# EAGLE design lidar_made_by_apple (EAGLE 9.6.2)
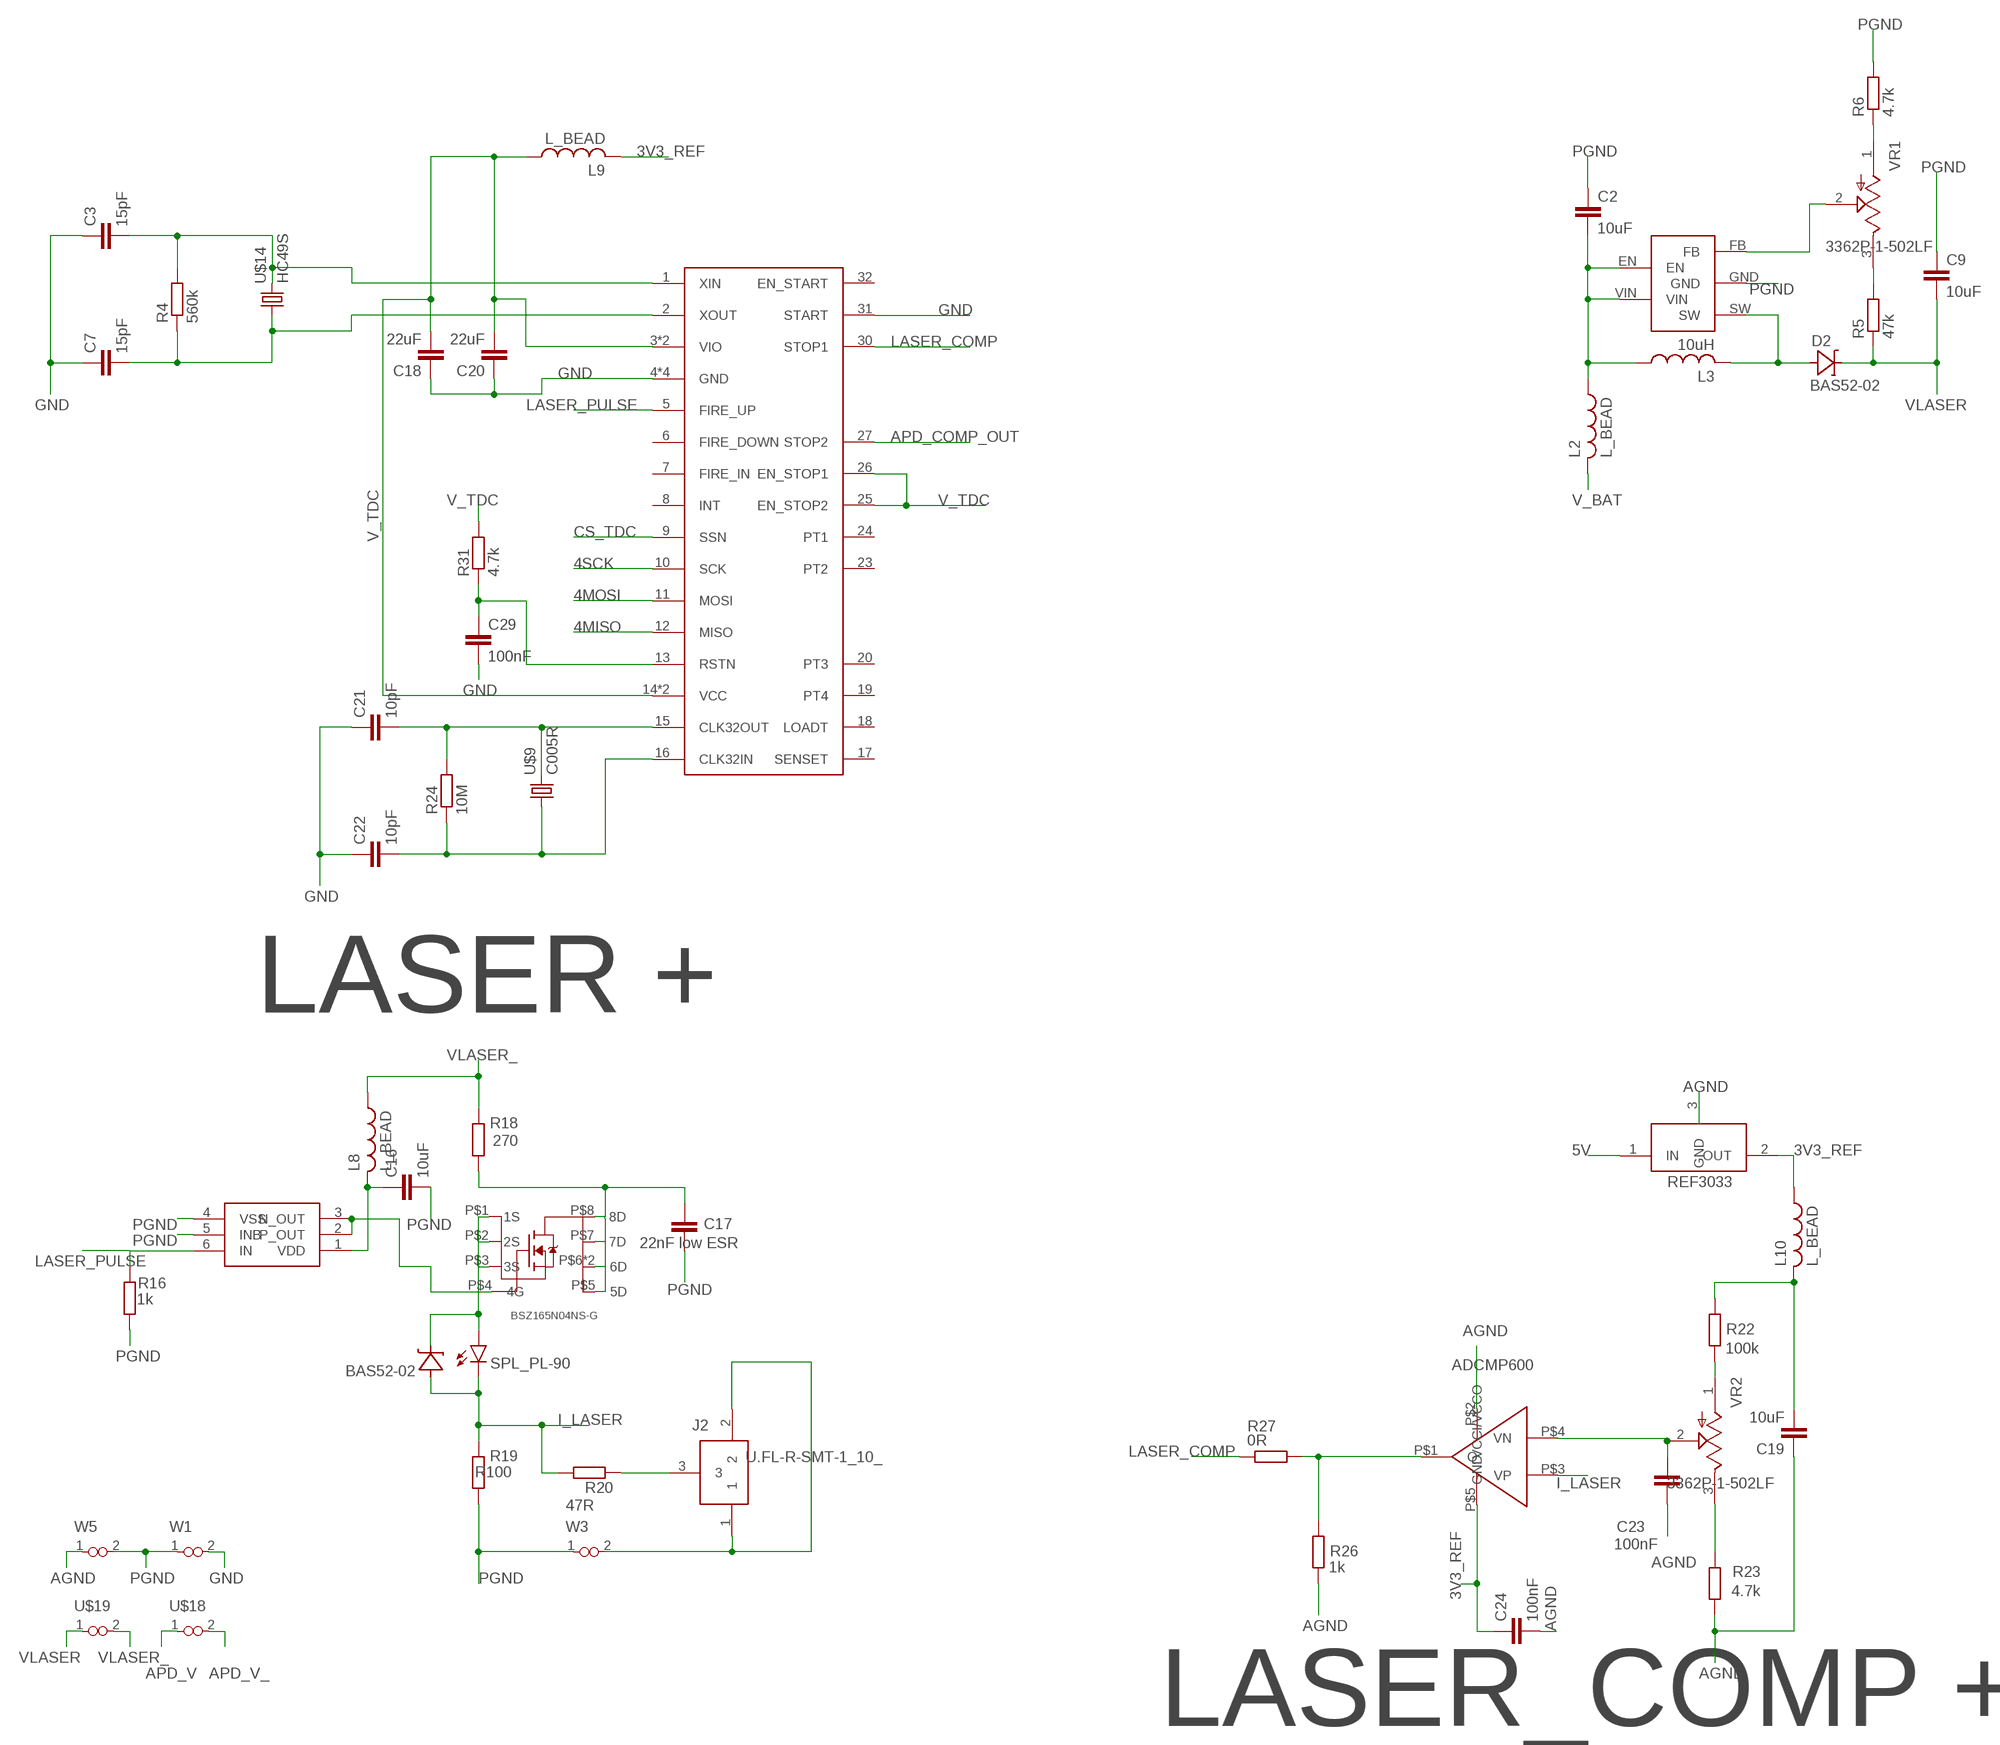
[diagram p0: schematic, sheet 1, part 1 of 2]
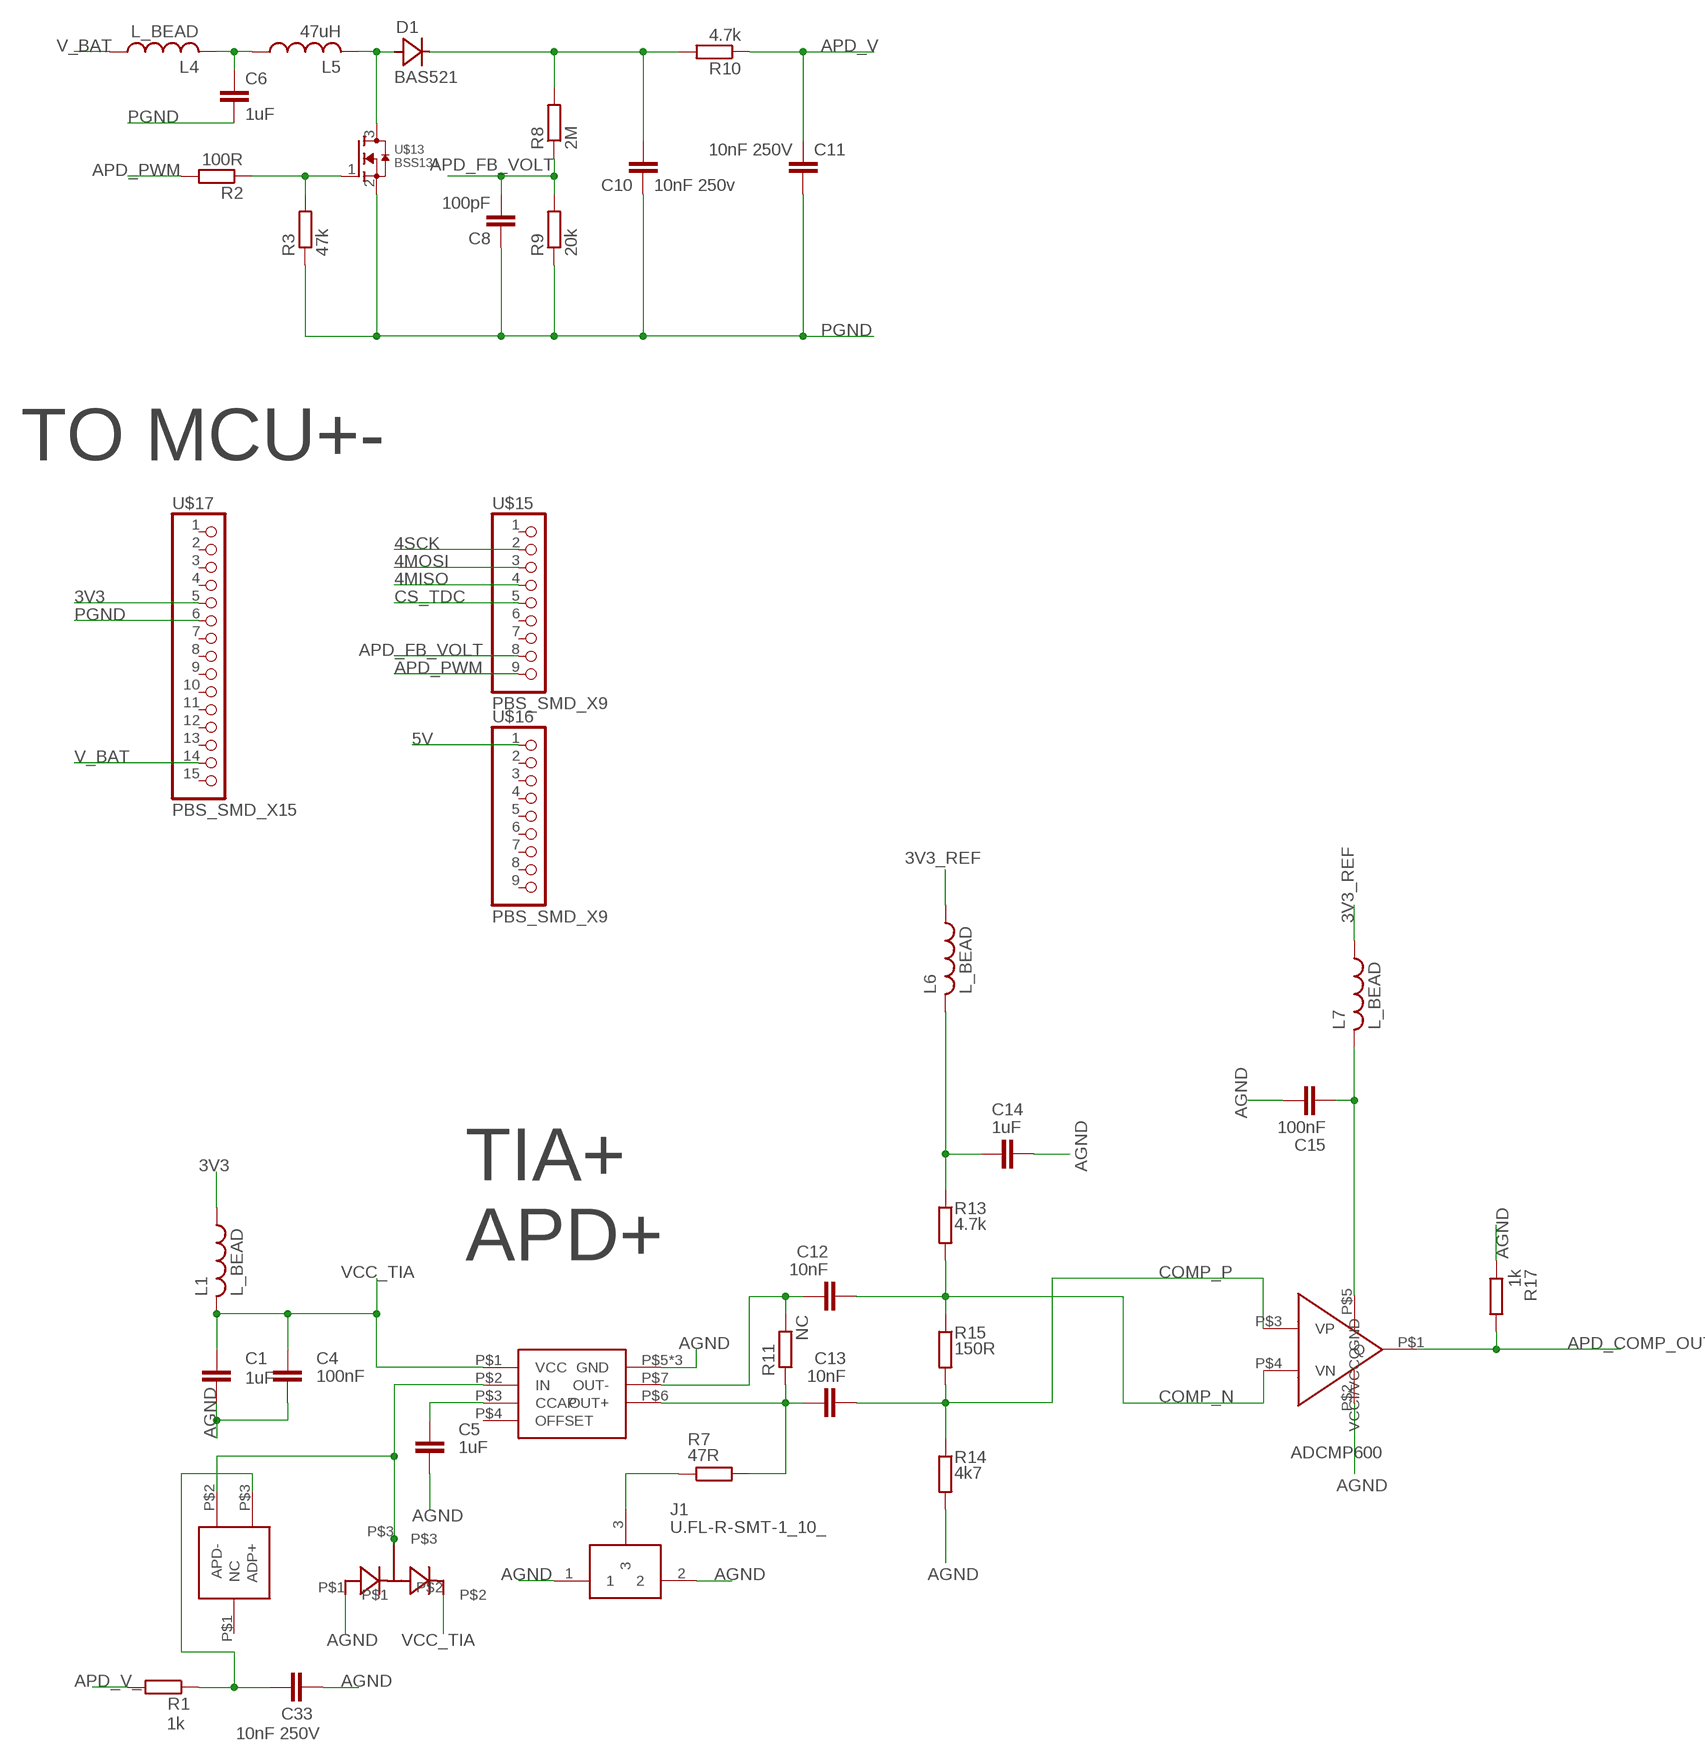
[diagram p1: schematic, sheet 1, part 2 of 2]

## Parts
C1  1uF  C-EUC0603  [C0603]
C2  10uF  C-EUC1206  [C1206]
C3  15pF  C-EUC0603  [C0603]
C4  100nF  C-EUC0603  [C0603]
C5  1uF  C-EUC0603  [C0603]
C6  1uF  C-EUC0603  [C0603]
C7  15pF  C-EUC0603  [C0603]
C8  100pF  C-EUC0603  [C0603]
C9  10uF  C-EUC1206  [C1206]
C10  10nF 250v  C-EUC0805  [C0805]
C11  10nF 250V  C-EUC0805  [C0805]
C12  10nF  C-EUC0603  [C0603]
C13  10nF  C-EUC0603  [C0603]
C14  1uF  C-EUC0603  [C0603]
C15  100nF  C-EUC0603  [C0603]
C16  10uF  C-EUC1206  [C1206]
C17  22nF low ESR  C-EUC0603  [C0603]
C18  22uF  C-EUC1206  [C1206]
C19  10uF  C-EUC1206  [C1206]
C20  22uF  C-EUC1206  [C1206]
C21  10pF  C-EUC0603  [C0603]
C22  10pF  C-EUC0603  [C0603]
C23  100nF  C-EUC0603  [C0603]
C24  100nF  C-EUC0603  [C0603]
C29  100nF  C-EUC0603  [C0603]
C33  10nF 250V  C-EUC0805  [C0805]
D1  BAS521  [SOD523]
D2  BAS52-02  [SOD523]
D6  BAV99  [BAV99]
J1  U.FL-R-SMT-1_10_  [U.FL-R-SMT-1(10)]
J2  U.FL-R-SMT-1_10_  [U.FL-R-SMT-1(10)]
L1  L_BEAD  [L_BEAD]
L2  L_BEAD  [L_BEAD]
L3  10uH  L_15MKH  [L_12X12]
L4  L_BEAD  [L_BEAD]
L5  47uH  CM322522-470KL  [1210]
L6  L_BEAD  [L_BEAD]
L7  L_BEAD  [L_BEAD]
L8  L_BEAD  [L_BEAD]
L9  L_BEAD  [L_BEAD]
L10  L_BEAD  [L_BEAD]
R1  1k  R-EU_R0603  [R0603]
R2  100R  R-EU_R0603  [R0603]
R3  47k  R-EU_R0603  [R0603]
R4  560k  R-EU_R0603  [R0603]
R5  47k  R-EU_R0603  [R0603]
R6  4.7k  R-EU_R0603  [R0603]
R7  47R  R-EU_R0603  [R0603]
R8  2M  R-EU_R0603  [R0603]
R9  20k  R-EU_R0603  [R0603]
R10  4.7k  R-EU_R0603  [R0603]
R11  NC  R-EU_R0603  [R0603]
R13  4.7k  R-EU_R0603  [R0603]
R14  4k7  R-EU_R0603  [R0603]
R15  150R  R-EU_R0603  [R0603]
R16  1k  R-EU_R0603  [R0603]
R17  1k  R-EU_R0603  [R0603]
R18  270  R-EU_R0603  [R0603]
R19  R100  R-EU_R2512  [R2512]
R20  47R  R-EU_R0603  [R0603]
R22  100k  R-EU_R0603  [R0603]
R23  4.7k  R-EU_R0603  [R0603]
R24  10M  R-EU_R0603  [R0603]
R26  1k  R-EU_R0603  [R0603]
R27  0R  R-EU_R0603  [R0603]
R31  4.7k  R-EU_R0603  [R0603]
REF3033  REF3033  [SOT23-3]
U$2  BSZ165N04NS-G  [BSZ165N04NS-G]
U$3  BAS52-02  [SOD523]
U$4  ADCMP600  [ADCMP600]
U$5  MAX40658-8-TDFN-3X3MM  [MAX40658-8-TDFN-3X3MM]
U$6  SPL_PL-90  [SPL_PL-90]
U$7  MTAPD-07-013  [MAPD-07-013]
U$8  ADCMP600  [ADCMP600]
U$9  C005R  [C005R]
U$10  TDC-GP21  [TDC-GP21]
U$11  MIC2288  [MIC2288]
U$12  LM5114  [SOT23-6]
U$13  BSS131  [SOT23-3]
U$14  HC49S  [HC49S]
U$15  PBS_SMD_X9  [PBS_SMD_X9]
U$16  PBS_SMD_X9  [PBS_SMD_X9]
U$17  PBS_SMD_X15  [PBD_SMD_X15]
U$18  VIAS-CONNECT  [VIAS-CONNECT]
U$19  VIAS-CONNECT  [VIAS-CONNECT]
VR1  3362P-1-502LF  [TRIM_3362P-1-502LF]
VR2  3362P-1-502LF  [TRIM_3362P-1-502LF]
W1  VIAS-CONNECT  [VIAS-CONNECT]
W3  VIAS-CONNECT  [VIAS-CONNECT]
W5  VIAS-CONNECT  [VIAS-CONNECT]

## Nets
3V3: L1.1 U$17.5
3V3_REF: C24.1 L6.1 L7.1 L9.2 L10.1 REF3033.2(OUT) U$4.P$5(VCCI/VCCO)
4MISO: U$10.12(MISO) U$15.4
4MOSI: U$10.11(MOSI) U$15.3
4SCK: U$10.10(SCK) U$15.2
5V: REF3033.1(IN) U$16.1
AGND: C1.2 C4.2 C5.2 C14.1 C15.1 C19.1 C23.2 C24.2 C33.2 D6.P$1 J1.1 J1.2 R14.2 R17.1 R23.1 R26.1 REF3033.3(GND) U$4.P$2(GND) U$5.P$5(GND) U$5.P$8(GND) U$5.P$9(GND) U$8.P$2(GND) W5.1
APD_COMP_OUT: R17.2 U$8.P$1(Q) U$10.27(STOP2)
APD_FB_VOLT: C8.2 R8.1 R9.2 U$15.8
APD_PWM: R2.2 U$15.9
APD_V: C11.2 R10.1 U$18.1
APD_V_: R1.2 U$18.2
COMP_N: C12.2 R13.2 R15.1 U$8.P$4(VN)
COMP_P: C13.2 R14.1 R15.2 U$8.P$3(VP)
CS_TDC: U$10.9(SSN) U$15.5
GND: C3.1 C7.1 C18.1 C20.1 C21.1 C22.1 C29.2 U$10.4(GND) U$10.21(GND) U$10.28(GND) U$10.31(START) U$10.P$1(GND) W1.2
I_LASER: R19.2 R20.2 U$3.P$2(A) U$4.P$3(VP) U$6.P$2(C)
LASER_COMP: R27.1 U$10.30(STOP1)
LASER_PULSE: R16.2 U$10.5(FIRE_UP) U$12.6(IN)
N$1: U$2.P$4(4G) U$12.2(P_OUT) U$12.3(N_OUT)
N$2: C16.1 L8.2 U$12.1(VDD)
N$3: C17.2 R18.1 U$2.P$5(5D) U$2.P$6(6D) U$2.P$7(7D) U$2.P$8(8D) U$2.P$9(6D)
N$4: U$2.P$1(1S) U$2.P$2(2S) U$2.P$3(3S) U$3.P$1(C) U$6.P$1(A)
N$5: C23.1 U$4.P$4(VN) VR2.2(WIPER)
N$6: C19.2 L10.2 R22.2
N$8: D6.P$3 U$5.P$2(IN) U$7.P$2(APD-)
N$9: C5.1 U$5.P$3(CCAP)
N$10: C12.1 R11.2 U$5.P$7(OUT-)
N$11: C13.1 R7.2 R11.1 U$5.P$6(OUT+)
N$12: J1.3 R7.1
N$13: C33.1 R1.1 U$7.P$3(ADP+)
N$14: C14.2 L6.2 R13.1
N$15: C15.2 L7.2 U$8.P$5(VCCI/VCCO)
N$16: J2.3 R20.1
N$17: R26.2 R27.2 U$4.P$1(Q)
N$18: J2.1 J2.2 W3.2
N$19: C7.2 R4.1 U$10.2(XOUT) U$14.P$1
N$20: C29.1 R31.1 U$10.13(RSTN)
N$21: C2.2 L2.1 L3.P$1 U$11.EN U$11.VIN
N$22: C21.2 R24.2 U$9.P$2 U$10.15(CLK32OUT)
N$23: C3.2 R4.2 U$10.1(XIN) U$14.P$2
N$25: C22.2 R24.1 U$9.P$1 U$10.16(CLK32IN)
N$26: D2.P$2(A) L3.P$2 U$11.SW
N$27: U$11.FB VR1.2(WIPER)
N$29: R2.1 R3.2 U$13.1(G)
N$31: D1.P$2 L5.2 U$13.3(D)
N$32: C10.2 D1.P$1 R8.2 R10.2
N$33: R6.1 VR1.1(CCW)
N$35: R5.2 VR1.3(CW)
N$36: C6.1 L4.2 L5.1
N$37: R22.1 VR2.1(CCW)
N$38: R23.2 VR2.3(CW)
PGND: C2.1 C6.2 C8.1 C9.1 C10.1 C11.1 C16.2 C17.1 R3.1 R6.2 R9.1 R16.1 R19.1 U$11.GND U$12.4(VSS) U$12.5(INB) U$13.2(S) U$17.6 W1.1 W3.1 W5.2
V_BAT: L2.2 L4.1 U$17.14
V_TDC: C18.2 C20.2 L9.1 R31.2 U$10.3(VIO) U$10.14(VCC) U$10.22(VIO) U$10.25(EN_STOP2) U$10.26(EN_STOP1) U$10.29(VCC)
VCC_TIA: C1.1 C4.1 D6.P$2 L1.2 U$5.P$1(VCC)
VLASER: C9.2 D2.P$1(C) R5.1 U$19.1
VLASER_: L8.1 R18.2 U$19.2
Unconnected: U$5.P$4(OFFSET) U$7.P$1(NC) U$10.6(FIRE_DOWN) U$10.7(FIRE_IN) U$10.8(INT) U$10.17(SENSET) U$10.18(LOADT) U$10.19(PT4) U$10.20(PT3) U$10.23(PT2) U$10.24(PT1) U$10.32(EN_START) U$15.1 U$15.6 U$15.7 U$16.2 U$16.3 U$16.4 U$16.5 U$16.6 U$16.7 U$16.8 U$16.9 U$17.1 U$17.2 U$17.3 U$17.4 U$17.7 U$17.8 U$17.9 U$17.10 U$17.11 U$17.12 U$17.13 U$17.15

## Notes on the sheet
- TO MCU+-
- LASER +
- TIA+
  APD+
- LASER_COMP +

## Library data of the parts
C1-C24 C29 C33 = rcl:C-EU: CAPACITOR, European symbol; SPICEPREFIX: C
D1 = NEON-BLADE-2024:BAS521
D2 U$3 = NEON-BLADE-2024:BAS52-02
D6 = NEON-BLADE-2024:BAV99
J1 J2 = U.FL-R-SMT-1_10_:U.FL-R-SMT-1_10_: UFL SMT PCB receptable,DC-6GHz Hirose Straight 50 Surface Mount UFL Connector, Receptacle, Solder Termination Coaxial Source: Datasheet <https://www.hirose.com/product/document?clcode=CL0331-0472-2-10&productname=U.FL-R-SMT-1(10)&series=U.FL&documenttype=2DDrawing&lang=en&documentid=0000940684>; ARROW_PART_NUMBER: U.FL-R-SMT-1(10); ARROW_PRICE-STOCK: https://www.arrow.com/en/products/u.fl-r-smt-1-10/hirose-electric; DESCRIPTION: UFL SMT PCB receptable,DC-6GHz Hirose Straight 50 Surface Mount UFL Connector, Receptacle, Solder Termination Coaxial; HEIGHT: mm; MANUFACTURER_NAME: Hirose; MANUFACTURER_PART_NUMBER: U.FL-R-SMT-1(10); MOUSER_PART_NUMBER: 798-U.FL-R-SMT-110; MOUSER_PRICE-STOCK: https://www.mouser.co.uk/ProductDetail/Hirose-Connector/U.FL-R-SMT-110?qs=kL1ClTr6oBoOdtqlGQpQrQ%3D%3D
L1 L2 L4 L6-L10 = NEON-BLADE-2024:L_BEAD
L3 = NEON-BLADE-2024:L_15MKH
L5 = NEON-BLADE-2024:CM322522-470KL
R1-R11 R13-R20 R22-R24 R26 R27 R31 = rcl:R-EU_: RESISTOR, European symbol; SPICEPREFIX: R
REF3033 = NEON-BLADE-2024:REF3033
U$2 = NEON-BLADE-2024:BSZ165N04NS-G
U$4 U$8 = NEON-BLADE-2024:ADCMP600
U$5 = NEON-BLADE-2024:MAX40658-8-TDFN-3X3MM
U$6 = NEON-BLADE-2024:SPL_PL-90
U$7 = NEON-BLADE-2024:MTAPD-07-013
U$9 = NEON-BLADE-2024:C005R
U$10 = NEON-BLADE-2024:TDC-GP21
U$11 = NEON-BLADE-2024:MIC2288
U$12 = NEON-BLADE-2024:LM5114
U$13 = NEON-BLADE-2024:BSS131
U$14 = NEON-BLADE-2024:HC49S
U$15 U$16 = NEON-BLADE-2024:PBS_SMD_X9
U$17 = NEON-BLADE-2024:PBS_SMD_X15
U$18 U$19 W1 W3 W5 = NEON-BLADE-2024:VIAS-CONNECT
VR1 VR2 = NEON-BLADE-2024:3362P-1-502LF: Res Cermet Trimmer 50K Ohm 10% 1/2W 1(Elec)/1(Mech)Turn 2.77mm (6.6 X 6.99 X 4.7mm) Pin Thru-Hole Tube Check prices <https://pricing.snapeda.com/parts/3362P-1-502LF/Bourns/view-part?ref=eda>; AVAILABILITY: Good; DESCRIPTION: 5 kOhms 0.5W, 1/2W PC Pins Through Hole Trimmer Potentiometer Cermet 1 Turn Top Adjustment; MF: Bourns; MP: 3362P-1-502LF; PACKAGE: 3362P-1 Bourns Inc.; PRICE: None; PURCHASE-URL: https://pricing.snapeda.com/search/part/3362P-1-502LF/?ref=eda

## Board
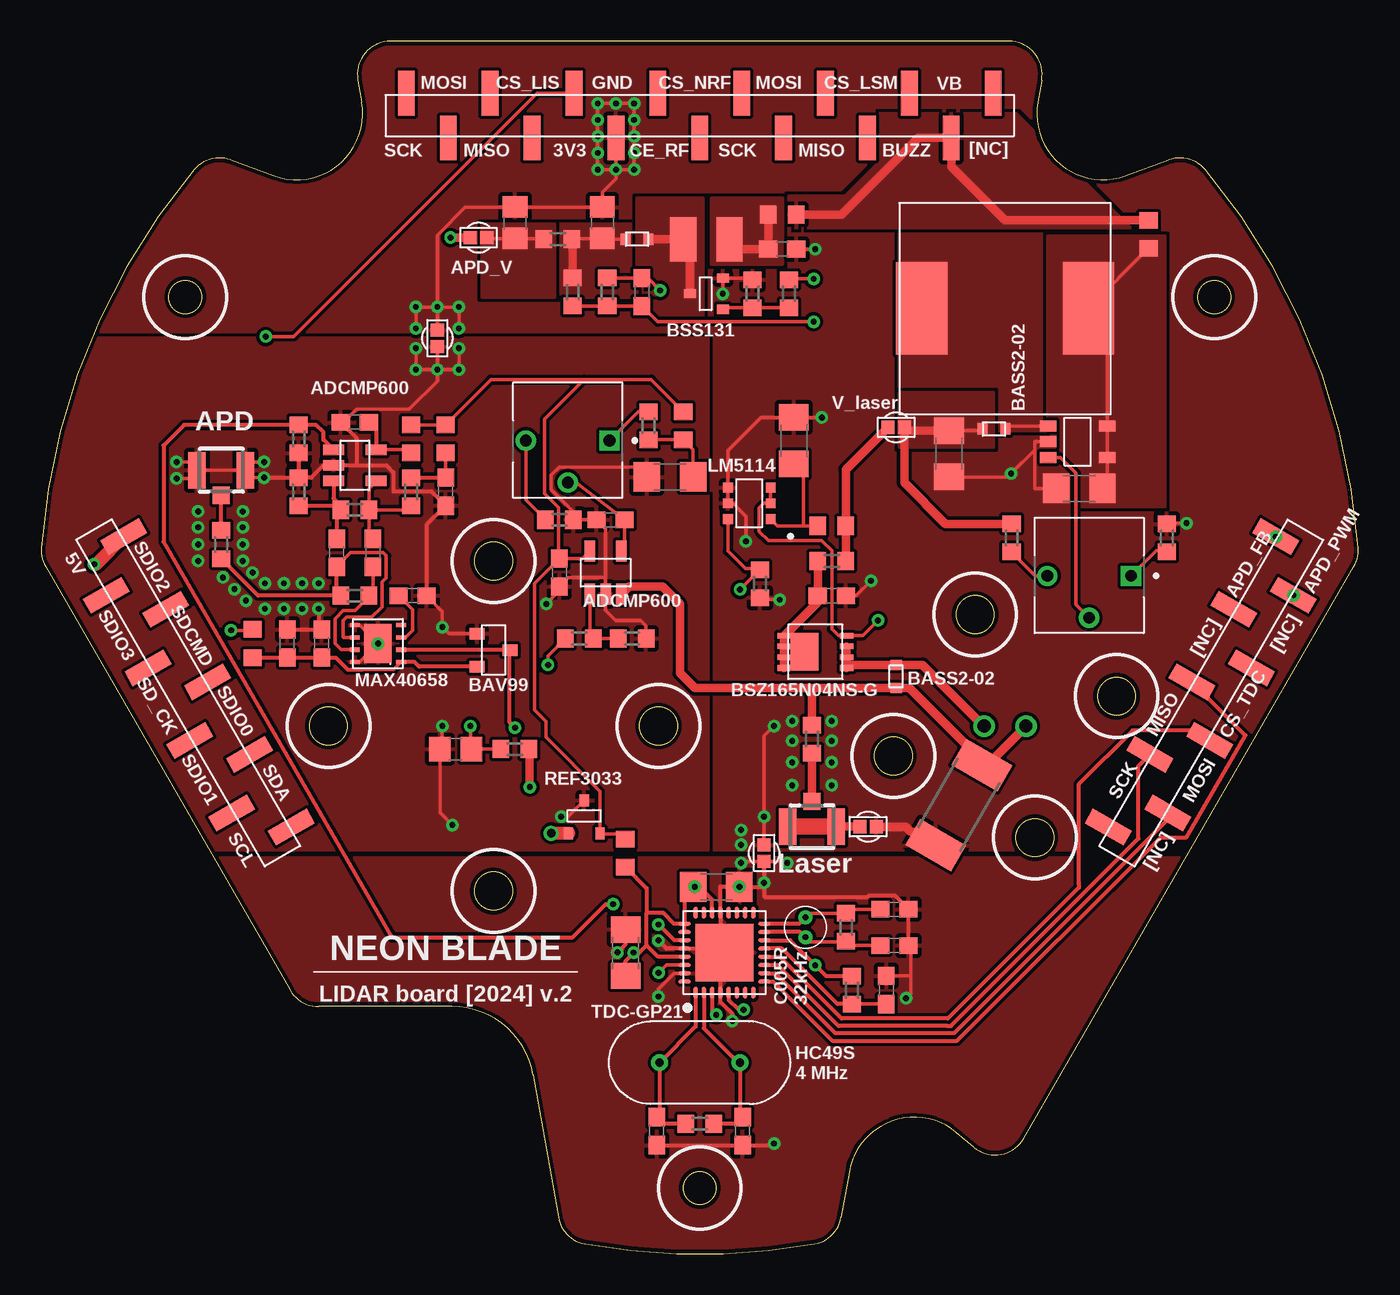
[diagram p2: board, top side]
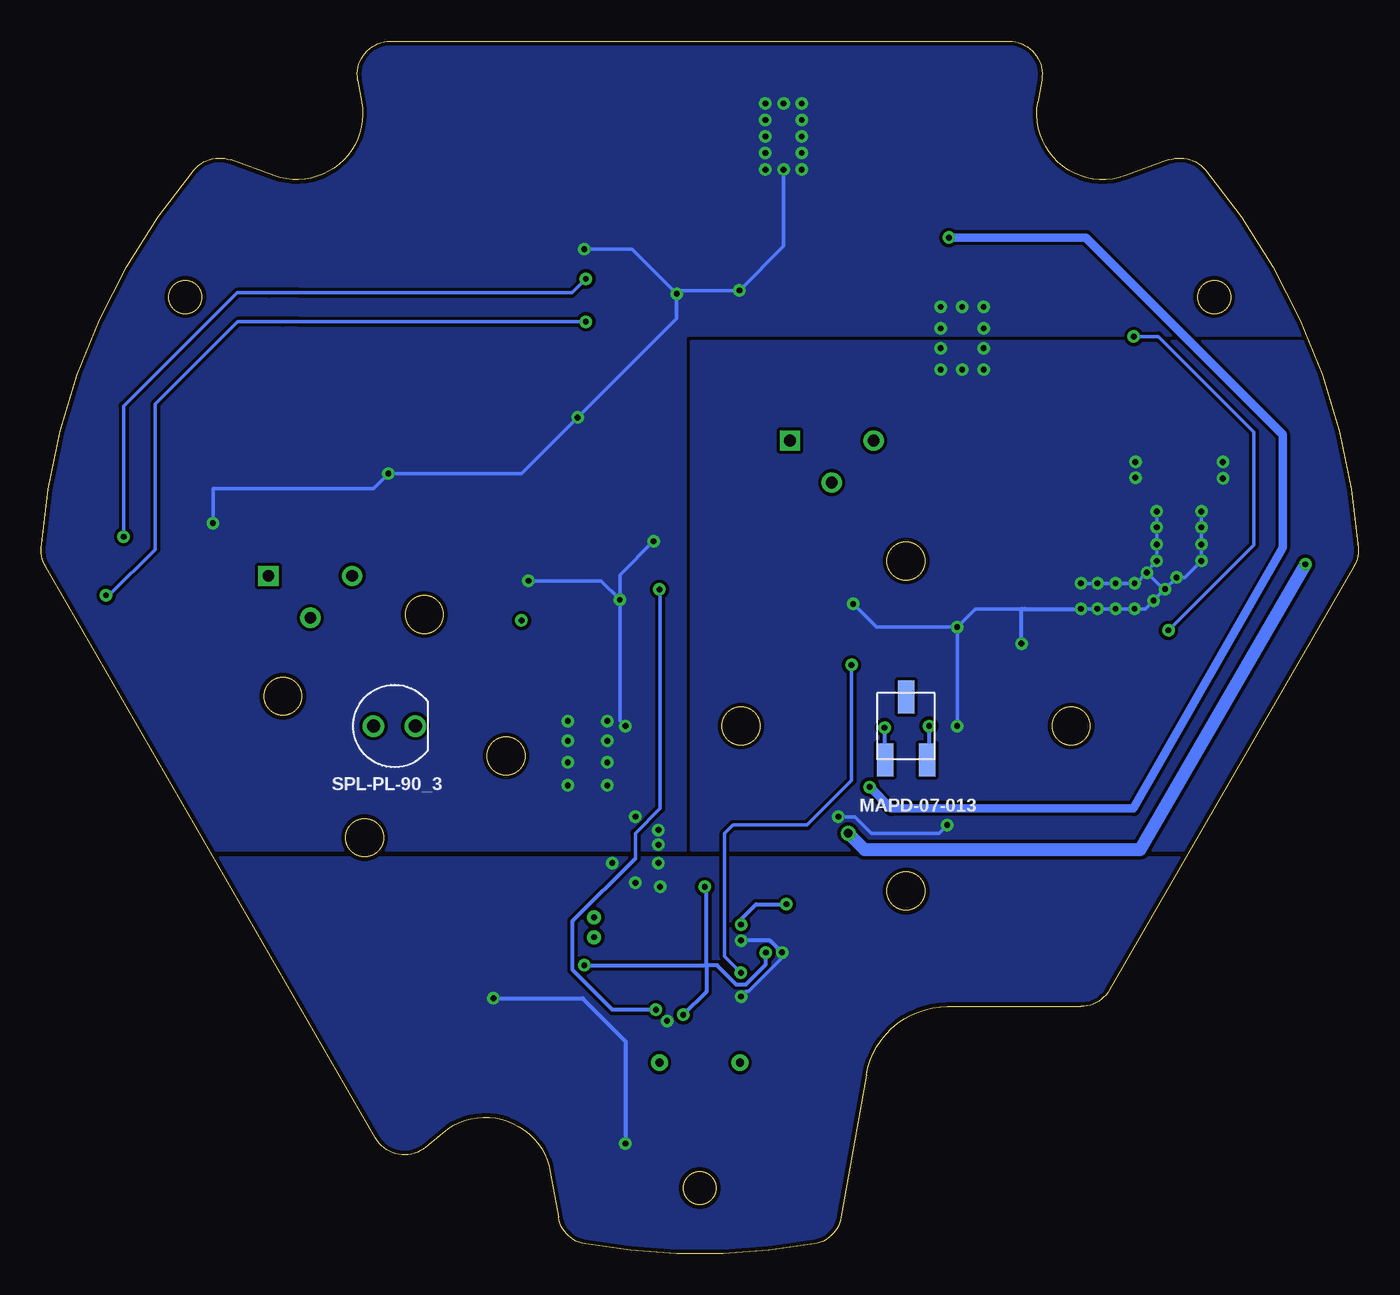
[diagram p3: board, bottom side, seen from below]

Size 79.81 x 73.48 mm. Coordinates in mm from the lower left corner, seen from the top.
Outline: 0.27,41.63 15.08,15.98 arc60 16.81,14.98 24.89,14.98 arc-80 29.81,10.84 31.33,2.21 arc70 32.96,0.58 arc20 46.86,0.58 arc70 48.48,2.21 48.96,4.96 arc-120 55.47,7.33 56.52,6.45 arc100 59.54,6.98 79.55,41.63 arc34 79.81,42.77 arc36 70.55,65.69 arc70 68.33,66.28 65.7,65.33 arc-120 60.39,69.78 60.63,71.13 arc100 58.66,73.48 21.15,73.48 arc100 19.18,71.13 19.42,69.78 arc-120 14.11,65.33 11.48,66.28 arc70 9.27,65.69 arc36 0,42.77 arc34 0.27,41.63
Outline: circle at 17.41,31.98 radius 1.15
Outline: circle at 37.41,31.98 radius 1.15
Outline: circle at 27.41,21.98 radius 1.15
Outline: circle at 27.41,41.98 radius 1.15
Outline: circle at 8.73,57.98 radius 1
Outline: circle at 65.17,33.79 radius 1.15
Outline: circle at 51.65,30.16 radius 1.15
Outline: circle at 60.22,25.21 radius 1.15
Outline: circle at 39.91,3.98 radius 1
Outline: circle at 56.6,38.74 radius 1.15
Outline: circle at 71.08,57.98 radius 1
Copper layers (1*16): Top 0.035mm / dielectric 1.5mm / Bottom 0.035mm
Design rules "default *": minimum track width 0.2mm, minimum drill 0.35mm, track to track 0.2mm, track to pad 0.2mm, pad to pad 0.2mm, via to via 0.2mm, smd to smd 0.2mm, copper to edge 10mil, drill to drill 6mil, minimum pad ring 10mil, minimum via ring 8mil, stop-mask expansion 4mil, vias tented up to drill 0mil, thermal gap 10mil

### Footprints (pad centres in the part's own frame; a part is rotated, then mirrored left to right if it is on the bottom)
C0603 = smd 1.1 x 1: 1 -0.85,0; 2 0.85,0
C1206 = smd 1.6 x 1.8: 1 -1.4,0; 2 1.4,0
C0805 = smd 1.3 x 1.5: 1 -0.95,0; 2 0.95,0
SOD523 = smd 0.7 x 0.6: P$1 0,-0.7; P$2 0,0.7
BAV99 = smd 0.7 x 0.9: P$1 -1,-1; P$2 1,-1; P$3 0,1
U.FL-R-SMT-1(10) = smd 1.05 x 2.2: 1 -1.475,0; 2 1.475,0 | smd 1.05 x 1.05: 3 0,1.525
L_BEAD = smd 1 x 1.1: 1 -0.85,0; 2 0.85,0
L_12X12 = smd 3.1 x 5.6: P$1 -5.05,0; P$2 5.05,0
1210 = smd 1.6 x 2.7: 1 -1.4,0; 2 1.4,0
R0603 = smd 1 x 1.1: 1 -0.85,0; 2 0.85,0
R2512 = smd 1.8 x 3.2: 1 -2.8,0; 2 2.8,0
SOT23-3 = smd 0.56 x 0.73: 1 -0.95,-1; 2 0.95,-1; 3 0,1
BSZ165N04NS-G = smd 0.8 x 0.34: P$1 -1.9,0.98; P$2 -1.9,0.33; P$3 -1.9,-0.33; P$4 -1.9,-0.98; P$5 1.9,-0.98; P$6 1.9,-0.33; P$7 1.9,0.33; P$8 1.9,0.98 | smd 1.69 x 2.29: P$9 0.655,0
ADCMP600 = smd 0.635 x 1.27: P$1 -0.95,-1.3; P$2 0,-1.3; P$3 0.95,-1.3; P$4 0.95,1.3; P$5 -0.95,1.3
MAX40658-8-TDFN-3X3MM = smd 0.25 x 0.6: P$1 -1.125,-1.4; P$2 -0.375,-1.4; P$3 0.375,-1.4; P$4 1.125,-1.4; P$5 1.125,1.4; P$6 0.375,1.4; P$7 -0.375,1.4; P$8 -1.125,1.4 | smd 2.38 x 1.65: P$9 0,0
SPL_PL-90 = drill 0.8: P$1 1.27,0; P$2 -1.27,0
MAPD-07-013 = smd 1 x 2: P$1 0,1.75; P$2 -1.27,-2.05; P$3 1.27,-2.05
C005R = drill 0.35 pad 0.85: P$1 0,0.6; P$2 0,-0.6
TDC-GP21 = smd 0.75 x 0.25: 1 -2.425,1.75; 2 -2.425,1.25; 3 -2.425,0.75; 4 -2.425,0.25; 5 -2.425,-0.25; 6 -2.425,-0.75; 7 -2.425,-1.25; 8 -2.425,-1.75; 17 2.425,-1.75; 18 2.425,-1.25; 19 2.425,-0.75; 20 2.425,-0.25; 21 2.425,0.25; 22 2.425,0.75; 23 2.425,1.25; 24 2.425,1.75 | smd 0.25 x 0.75: 9 -1.75,-2.425; 10 -1.25,-2.425; 11 -0.75,-2.425; 12 -0.25,-2.425; 13 0.25,-2.425; 14 0.75,-2.425; 15 1.25,-2.425; 16 1.75,-2.425; 25 1.75,2.425; 26 1.25,2.425; 27 0.75,2.425; 28 0.25,2.425; 29 -0.25,2.425; 30 -0.75,2.425; 31 -1.25,2.425; 32 -1.75,2.425 | smd 3.5 x 3.5: P$1 0,0
MIC2288 = smd 0.66 x 1: EN -0.95,-1.8; FB -0.95,1.8; GND 0,1.8; SW 0.95,1.8; VIN 0.95,-1.8
SOT23-6 = smd 0.6 x 0.6: 1 -0.95,-1.3; 2 0,-1.3; 3 0.95,-1.3; 4 0.95,1.3; 5 0,1.3; 6 -0.95,1.3
HC49S = drill 0.5: P$1 -2.44,0; P$2 2.44,0
PBS_SMD_X9 = smd 1.02 x 2.7: 1 -10.16,1.35; 2 -7.62,-1.35; 3 -5.08,1.35; 4 -2.54,-1.35; 5 0,1.35; 6 2.54,-1.35; 7 5.08,1.35; 8 7.62,-1.35; 9 10.16,1.35
PBD_SMD_X15 = smd 1.02 x 2.7: 1 -17.78,1.35; 2 -15.24,-1.35; 3 -12.7,1.35; 4 -10.16,-1.35; 5 -7.62,1.35; 6 -5.08,-1.35; 7 -2.54,1.35; 8 0,-1.35; 9 2.54,1.35; 10 5.08,-1.35; 11 7.62,1.35; 12 10.16,-1.35; 13 12.7,1.35; 14 15.24,-1.35; 15 17.78,1.35
VIAS-CONNECT = smd 0.8 x 0.8: 1 -0.5,0; 2 0.5,0
TRIM_3362P-1-502LF = drill 0.714 square: 1 -2.54,0 | drill 0.714: 2 0,2.54; 3 2.54,0

### Placement (x,y rotation side)
C1  14.91,36.98 90 top
C2  62.91,46.38 0 top
C3  37.31,7.43 90 top
C4  17.01,36.98 90 top
C5  22.51,39.88 0 top
C6  44.91,60.88 0 top
C7  42.51,7.43 90 top
C8  36.41,58.28 270 top
C9  55.01,48.48 90 top
C10  34.01,62.48 270 top
C11  28.71,62.48 270 top
C12  20.11,42.48 90 top
C13  17.91,42.48 90 top
C14  24.51,46.18 90 top
C15  19.01,50.38 0 top
C16  45.61,49.28 90 top
C17  47.91,39.88 180 top
C18  35.42,18.24 270 top
C19  38.11,47.08 0 top
C20  40.91,22.23 180 top
C21  51.71,18.68 180 top
C22  51.71,20.88 180 top
C23  34.51,44.48 180 top
C24  31.41,41.28 270 top
C29  51.22,15.98 90 top
C33  25.11,30.58 180 top
D1  36.11,61.48 270 top
D2  57.74,49.98 270 top
D6  27.41,36.58 270 top
J1  10.91,47.48 180 top
J2  46.71,25.88 0 top
L1  12.81,36.98 270 top
L2  67.11,61.78 90 top
L3  58.41,57.28 180 top
L4  44.91,62.98 180 top
L5  40.31,61.48 180 top
L6  24.51,49.38 270 top
L7  22.41,49.38 270 top
L8  47.91,44.11 180 top
L9  35.4,24.28 90 top
L10  38.91,50.18 270 top
R1  28.71,30.58 0 top
R2  45.31,58.18 90 top
R3  43.11,58.18 270 top
R4  39.91,7.88 180 top
R5  58.81,43.38 270 top
R6  68.21,43.38 90 top
R7  10.91,42.98 270 top
R8  32.21,58.28 90 top
R9  34.31,58.28 270 top
R10  31.31,61.48 0 top
R11  19.01,39.88 0 top
R13  22.41,46.18 270 top
R14  15.61,46.18 90 top
R15  19.01,45.08 180 top
R16  43.56,40.61 90 top
R17  15.61,49.38 90 top
R18  47.91,41.98 0 top
R19  55.61,27.18 60 top
R20  46.71,31.18 90 top
R22  36.81,50.18 270 top
R23  31.41,44.48 180 top
R24  48.78,19.78 270 top
R26  35.81,37.28 180 top
R27  32.61,37.28 0 top
R31  49.14,15.98 90 top
REF3033  32.91,26.48 0 top
U$2  46.91,36.48 180 top
U$3  51.81,34.98 180 top
U$4  34.21,41.28 0 top
U$5  20.41,36.98 90 top
U$6  58.41,31.98 0 bottom
U$7  27.41,31.98 0 bottom
U$8  19.01,47.78 270 top
U$9  46.31,19.78 0 top
U$10  41.41,18.25 90 top
U$11  62.81,49.21 90 top
U$12  42.91,45.48 90 top
U$13  40.31,58.18 90 top
U$14  39.91,11.58 180 top
U$15  70.91,33.98 60 top
U$16  8.91,33.98 300 top
U$17  39.91,68.98 0 top
U$18  26.51,61.58 180 top
U$19  51.81,50.08 180 top
VR1  63.51,41.08 180 top
VR2  31.91,49.28 180 top
W1  43.81,24.28 270 top
W3  50.11,25.88 180 top
W5  24.01,55.48 90 top

### Tracks (layer width: path | path; a pad name or v marks a point on that pad's centre or on a via)
3V3  (via drill 0.35)
  Top 0.2: U$17.5 30.06,70.33 15.31,55.58 v13.61,55.58 | L1.1 12.76,37.78 v11.51,37.78
  Bottom 0.2: v11.51,37.78 6.33,42.95 6.33,49.8 12.11,55.58 v13.61,55.58
3V3_REF
  Top 0.2: L9.2 35.1,25.43 33.91,25.43 REF3033.2 33.86,28.03 30.58,31.3 30.58,32.26 29.91,32.93 29.91,40.63 C24.1 | L10.1 36.96,52.98 32.91,52.98 | L7.1 L6.1 27.26,52.98 32.91,52.98 | 32.91,52.98 30.51,50.58 30.51,46.06 31.36,45.21 31.36,42.18 C24.1 | U$4.P$5 32.81,42.13 C24.1
4MISO
  Top 0.25: U$10.12 44.76,18 48.5,14.25 54.94,14.25 62.88,22.19 62.88,22.34 62.88,22.48 62.88,28.46 66.14,31.72 70.19,31.72 U$15.4
4MOSI
  Top 0.2: 67.16,30.22 U$15.3
  Top 0.25: 67.16,30.22 66.49,29.55 66.49,25.16 55.13,13.8 54.91,13.8 48.31,13.8 44.62,17.5 U$10.11
4SCK
  Top 0.25: U$10.10 44.48,17 48.13,13.35 55.32,13.35 68.27,26.3 U$15.2
5V  (via drill 0.35, 0.5)
  Top 0.8: REF3033.1 v30.91,25.48 | U$16.1 3.32,41.78 v3.21,41.78
  Bottom 0.8: v30.91,25.48 29.91,24.48 13.22,24.48 v3.21,41.78
AGND  (via drill 0.35)
  Top 0.2: REF3033.3 31.91,26.48 v31.51,26.48 | 34.21,40.98 U$4.P$2 34.21,38.98 34.81,38.38 36.31,38.38 36.66,38.03 R26.1 | 34.21,40.98 34.21,43.93 C23.2 R23.1 32.26,44.96 30.91,46.31 30.91,47.18 31.41,47.68 36.11,47.68 C19.1 | 34.21,40.98 31.96,40.98 C24.2 31.41,40.18 v30.61,39.38 | C15.1 18.31,50.38 19.11,51.18 22.31,51.18 24.01,52.88 v24.01,53.58 | 9.61,47.48 J1.2 8.93,47.98 v8.21,47.98 | 9.61,47.48 J1.1 | W5.1 v24.01,53.58 | v22.71,54.88 v22.71,53.58 v24.01,53.58 | v24.01,53.58 v25.31,53.58 v25.31,54.88 | v13.51,47.03 12.83,47.03 J1.1 | v8.21,46.98 9.11,46.98 9.61,47.48 | v24.31,31.98 24.31,30.73 C33.2 24.16,26.73 v24.91,25.98 | v13.51,47.98 12.88,47.98 J1.1 | U$5.P$8 19.28,35.85 U$5.P$9 19.28,38.1 U$5.P$5 | C5.2 24.31,38.93 v24.31,37.98 24.71,37.58 D6.P$1
  Top 0.25: C1.2 C4.2 16.81,38.03 v16.81,39.08 | R14.2 16.36,47.03 17.11,47.78 U$8.P$2 19.11,47.78 | R17.1 R14.2 | v13.51,47.03 R14.2 | C5.2 23.36,44.18 C14.1 23.63,46.2 21.33,46.2 21.33,47.35 20.9,47.78 19.11,47.78 | 19.11,47.78 19.11,49.43 C15.1
  Bottom 0.2: v31.51,26.48 30.51,26.48 29.51,25.48 25.41,25.48 v24.91,25.98 | v16.81,39.08 v15.81,39.08 v14.71,39.08 v13.56,39.08 12.91,39.08 v12.41,39.58 v11.71,40.28 | v11.71,40.28 v11.01,40.98 10.51,40.98 v9.51,41.98 v9.51,42.98 v9.51,44.02 v9.51,44.98 | v12.21,44.98 v12.21,44.02 v12.21,42.98 v12.21,41.98 12.81,41.38 v12.81,41.28 | v12.81,41.28 13.46,40.63 v13.56,40.63 v14.71,40.63 v15.81,40.63 v16.81,40.63 | v12.81,41.28 11.81,40.28 v11.71,40.28 | 20.21,39.08 23.21,39.08 v24.31,37.98 | v24.31,31.98 v24.31,37.98 | v24.31,37.98 29.21,37.98 v30.61,39.38
  Bottom 0.25: v16.81,39.08 20.21,39.08 20.41,39.08 U$5.P$9
  other vias: 20.41,36.98
  pour Top: 40.41,55.48 40.41,24.48 -0.29,24.48 -0.29,55.48
  pour Bottom: 40.41,55.28 40.41,24.48 -0.99,24.48 -0.99,55.28
APD_COMP_OUT  (via drill 0.35)
  Top 0.25: U$10.27 38.38,19 37.44,19.93 v37.41,19.93 | v34.65,21.18 34.21,21.18 32.21,19.18 21.26,19.18 7.41,43.15 7.41,48.98 8.66,50.23 R17.2 16.66,50.23 17.11,49.78 17.11,49.33 U$8.P$1
  Bottom 0.25: v34.65,21.18 36.49,21.18 37.41,20.26 v37.41,19.93
APD_FB_VOLT  (via drill 0.35)
  Top 0.2: R8.1 R9.2 C8.2 37.36,56.48 v46.81,56.48
  Bottom 0.2: U$15.8 75.68,39.9 72.91,42.68 72.91,51.48 67.91,56.48 65.21,56.48 64.21,56.48 v46.81,56.48
  other vias: 75.89,39.9
APD_PWM  (via drill 0.35)
  Top 0.2: v46.81,59.08 45.36,59.08 R2.2
  Bottom 0.2: U$15.9 74.82,51.36 67.95,58.24 66.01,58.24 64.2,58.24 47.65,58.24 v46.81,59.08
  other vias: 74.82,43.45
APD_V
  Top 0.2: R10.1 30.41,61.53 C11.2 27.06,61.53 U$18.1
  pour Top (no thermals): 31.11,62.38 26.71,62.38 26.71,57.98 31.11,57.98
APD_V_  (via drill 0.35)
  Top 0.5: v29.61,28.28 29.61,30.53 R1.2 | U$18.2 v24.81,61.58
  Bottom 0.5: v29.61,28.28 28.31,26.98 13.62,26.98 4.58,42.79 4.58,49.65 16.51,61.58 v24.81,61.58
COMP_N
  Top 0.2: C12.2 19.86,43.58 R15.1 | R15.1 19.86,46.38 U$8.P$4 | R13.2 22.16,45.08 R15.1
COMP_P
  Top 0.25: R15.2 17.91,44.83 C13.2 | R15.2 18.28,45.2 17.71,45.78 U$8.P$3 | R14.1 17.91,45.33 R15.2
CS_TDC
  Top 0.25: U$10.9 44.35,16.5 47.94,12.9 55.5,12.9 67.84,25.24 69.39,25.24 72.97,31.42 U$15.5
GND  (via drill 0.35)
  Top 0.2: 52.71,16.83 C29.2 | C22.1 C21.1 52.71,18.53 52.71,16.83 | 52.71,16.83 52.71,15.78 v52.41,15.48 | 40.91,18.5 41.16,18.5 U$10.P$1 | U$10.31 38.34,17 37.41,16.06 v37.41,15.58 | v45.21,23.68 45.11,23.78 W1.2 42.51,23.78 v42.41,23.68
  Top 0.25: C3.1 C7.1 44.31,6.58 v44.41,6.68 | 41.16,18.5 U$10.21 41.16,22.23 C20.1 43.81,22.23 | 40.91,18.5 U$10.28 37.89,18.5 v37.41,18.98 | U$10.P$1 41.16,18 U$10.4 41.16,15.26 41.88,14.53 v41.88,14.1 | C22.1 51.73,21.7 50.17,21.7 50.1,21.63 43.81,21.63 43.81,22.23 | W1.2 v43.81,22.48 43.81,22.23 | C18.1 35.42,18.75 v34.92,18.25
  Bottom 0.2: v37.41,15.58 37.09,15.89 36.94,15.89 34.92,17.91 v34.92,18.25
  Bottom 0.25: v44.41,6.68 44.41,12.88 47.01,15.48 v52.41,15.48 | v34.92,18.25 35.64,18.98 v37.41,18.98
  other vias: 42.31,22.23
  pour Top: -0.39,23.98 80.91,23.98 80.91,-3.52 -0.39,-3.52
  pour Bottom: -0.99,23.98 80.91,23.98 80.91,-2.52 -0.99,-2.52
I_LASER
  Top 0.2: R19.2 57.29,29.88 57.6,29.88
  Top 0.5: U$6.P$2 59.68,31.95 59.67,31.95 57.6,29.88 57.39,29.67 56.03,29.67 56.03,30.85 52.61,34.28 U$3.P$2 46.71,34.28 | R20.2 46.71,34.28 | 46.71,34.28 39.61,34.28 38.71,35.18 38.71,39.38 37.66,40.43 35.61,40.43 U$4.P$3
LASER_COMP  (via drill 0.35)
  Top 0.2: U$10.30 37.89,17.5 v37.41,17.02 | R27.1 30.71,36.23 v30.71,35.68
  Bottom 0.2: v37.41,17.02 38.41,18.02 38.41,25.48 37.91,25.98 33.41,25.98 30.71,28.68 v30.71,35.68
LASER_PULSE  (via drill 0.35)
  Top 0.2: v42.35,40.25 v42.36,40.25 R16.2 43.51,41.51 42.68,41.51 41.61,42.58 U$12.6
  Top 0.25: U$10.5 41.66,15.39 42.27,14.78 v42.56,14.78
  Bottom 0.2: 43.81,23.95 43.81,25.47 42.31,26.98 42.31,40.21 v42.35,40.25
  Bottom 0.25: v42.56,14.78 45.2,14.78 47.61,17.18 47.61,20.15 43.81,23.95
N$1  (via drill 0.35)
  Top 0.2: U$12.3 U$12.2 43.81,45.48 43.51,45.18 43.51,43.78 44.06,43.23 47.28,43.23 47.91,42.6 47.91,37.85 48.3,37.46 U$2.P$4 49.79,37.46 v50.71,38.38
N$2
  Top 0.2: C16.1 46.21,47.28 46.21,44.13 46.23,44.11 | 46.23,44.11 L8.2 | U$12.1 44.63,44.11 46.23,44.11
N$3
  Top 0.2: C17.2 47.06,39.48 | U$2.P$6 45.92,36.81 U$2.P$9 | U$2.P$7 45.92,36.15 U$2.P$9 | U$2.P$8 45.59,35.5 45.61,35.48 46.25,36.12 U$2.P$9 | U$2.P$5 45.83,37.46 46.25,37.03 U$2.P$9
  Top 0.5: R18.1 47.06,39.48 45.04,37.46 U$2.P$5 U$2.P$6 U$2.P$7 U$2.P$8
N$4
  Top 0.5: U$2.P$3 U$2.P$2 U$2.P$1 48.99,35.68 U$3.P$1 53.41,35.68 57.11,31.98 U$6.P$1
N$5
  Top 0.2: VR2.2 32.41,46.74 C23.1 35.36,42.78 U$4.P$4
N$6
  Top 0.2: R22.2 L10.2 39.51,48.73 C19.2
N$8  (via drill 0.35)
  Top 0.25: U$5.P$2 28.38,36.6 | 28.38,36.6 D6.P$3 | v28.71,31.88 28.38,32.2 28.38,36.6
  Bottom 0.25: U$7.P$2 28.68,31.85 v28.71,31.88
N$9
  Top 0.2: U$5.P$3 22.08,37.35 22.51,37.78 22.51,39.03 C5.1
N$10
  Top 0.2: U$5.P$7 18.18,36.6 17.81,36.98 17.81,38.48 18.31,38.98 19.01,38.98 19.86,39.83 R11.2 20.11,40.13 C12.1
N$11
  Top 0.2: U$5.P$6 18.33,37.35 18.31,37.38 18.31,38.38 18.51,38.58 20.03,38.58 20.66,39.2 20.66,40.7 20.91,40.95 20.91,42.3 20.73,42.48 18.76,42.48 C13.1
  Top 0.25: C13.1 17.91,40.13 R11.1 13.16,39.88 R7.2
N$12
  Top 0.25: R7.1 J1.3
N$13  (via drill 0.35)
  Top 0.2: v26.01,31.98 26.01,30.63 C33.1 R1.1
  Bottom 0.25: U$7.P$3 26.01,30.06 v26.01,31.98
N$14
  Top 0.2: L6.2 C14.2
  Top 0.25: R13.1 C14.2
N$15
  Top 0.2: U$8.P$5 22.21,48.73 L7.2
  Top 0.25: C15.2 20.31,49.93 U$8.P$5
N$16
  Top 0.5: R20.1 J2.3
N$17
  Top 0.2: R26.2 R27.2 33.26,37.48 U$4.P$1
N$18
  Top 0.5: W3.2 J2.2
  Top 1: J2.1 J2.2
N$19
  Top 0.2: U$14.P$1 42.35,11.48 | 42.35,8.44 C7.2 42.11,7.88
  Top 0.25: 42.35,8.44 42.35,11.48 40.16,13.67 U$10.2 | 42.11,7.88 R4.1
N$20
  Top 0.2: C29.1 R31.1
  Top 0.25: U$10.13 44.89,18.5 48.26,15.13 R31.1
N$21
  Top 0.2: C2.2 64.61,46.68 U$11.EN U$11.VIN 64.61,56.13 L3.P$1 L2.1
  pour Top (no thermals): 61.01,45.28 68.11,45.28 68.11,61.68 61.01,61.68
N$22
  Top 0.2: R24.2 48.82,18.89 | 48.82,18.89 49.03,18.68 C21.2 | U$9.P$2 46.6,18.89 48.82,18.89
  Top 0.25: U$9.P$2 45.99,19.5 U$10.15
N$23
  Top 0.2: 37.47,8.44 C3.2 37.71,7.88
  Top 0.25: 37.47,8.44 U$14.P$2 39.66,13.77 U$10.1 | R4.2 37.71,7.88
N$25
  Top 0.2: C22.2 49.03,20.88 R24.1 46.56,20.63 U$9.P$1 | 43.91,20 U$10.16
  Top 0.25: U$9.P$1 45.93,20 43.91,20
N$26
  Top 0.2: U$11.SW 58.44,50.16 D2.P$2
  pour Top (rank 2, no thermals): 60.91,61.78 52.01,61.78 52.01,49.88 60.91,49.88
N$27
  Top 0.2: VR1.2 62.71,39.34 62.71,47.3 61.75,48.26 U$11.FB
N$29
  Top 0.2: U$13.1 41.41,57.33 R3.2 R2.1
N$31
  Top 0.2: 39.31,61.08 L5.2
  Top 0.5: D1.P$2 L5.2 | U$13.3 39.31,61.08
  pour Top (no thermals): 40.11,56.78 36.11,56.78 36.11,63.98 40.11,63.98
N$32
  Top 0.2: R10.2 32.21,61.53 C10.2 34.06,61.48 D1.P$1
  Top 0.5: 32.21,61.53 R8.2
  pour Top (rank 2, no thermals): 31.11,62.38 36.11,62.38 36.11,57.98 31.11,57.98
N$33
  Top 0.2: VR1.1 67.58,42.61 R6.1
N$35
  Top 0.2: VR1.3 60.26,41.08 R5.2
N$36
  Top 0.5: L5.1 42.31,60.88 C6.1 L4.2
  pour Top (no thermals): 40.61,59.98 44.91,59.98 44.91,63.98 40.61,63.98
N$37
  Top 0.2: VR2.1 36.2,51.03 R22.1
N$38
  Top 0.2: R23.2 29.37,45.67 VR2.3
PGND  (via drill 0.35)
  Top 0.2: v69.41,44.28 68.26,44.28 R6.2 | v44.75,39.63 43.68,39.63 R16.1 | W1.1 v43.81,26.48 43.81,31.38 v44.41,31.98 | U$17.6 v34.83,65.7 | v34.83,65.7 34.83,65.15 34.01,64.33 C10.1 C11.1 25.7,63.43 24.01,61.73 v24.01,57.38 | v24.01,57.38 W5.2 | 60.21,48.71 60.21,49.21 U$11.GND | 60.21,48.71 60.21,46.38 C2.1 | C9.1 58.57,47.08 v58.77,47.28 60.21,48.71 | v47.31,50.68 C16.2 43.61,50.68 41.61,48.68 U$12.4 U$12.5 41.91,45.48 42.71,44.68 v42.71,43.18 | 50.58,25.85 W3.1 | v37.51,58.38 36.76,59.13 C8.1 R9.1 | R3.1 43.01,59.13 U$13.2 v41.31,58.18 | C6.2 v46.91,60.88 | v34.83,65.7 v33.73,65.7 v33.73,66.71 v33.73,67.71 v33.73,68.71 v33.73,69.71 v34.83,69.71 v35.93,69.71 v35.93,68.71 v35.93,67.71 v35.93,66.71 v35.93,65.7 v34.83,65.7 | v24.01,57.38 v22.71,57.38 v22.71,56.08 | v24.01,57.38 v25.31,57.38 v25.31,56.08 | C17.1 49.38,39.88 v50.28,40.78
  Top 0.5: R19.1 53.41,25.55 52.71,25.55 52.41,25.85 50.58,25.85
  Bottom 0.2: v69.41,44.28 69.41,46.38 59.67,46.38 v58.77,47.28 50.71,47.28 v47.31,50.68 41.31,56.68 v41.31,58.18 | v44.41,31.98 44.75,32.32 v44.75,39.63 | v34.83,65.7 34.83,61.06 v37.51,58.38 41.11,58.38 v41.31,58.18 | v41.31,58.18 44.01,60.88 v46.91,60.88 | v44.75,39.63 44.75,41.13 v42.71,43.18 | v44.75,39.63 45.9,40.78 v50.28,40.78
  other vias: 45.51,32.28 45.51,31.08 45.51,29.78 45.51,28.38 47.91,32.28 47.91,31.08 47.91,29.78 47.91,28.38 42.41,24.78 42.41,25.68
  pour Top (rank 6): -0.39,74.08 -0.39,24.48 80.91,24.48 80.91,74.08
  pour Bottom (rank 2): -0.99,74.28 -0.99,24.48 80.91,24.48 80.91,74.28
  pour Top (rank 3, no thermals): 62.91,49.68 57.71,49.68 56.81,48.78 52.51,48.78 52.51,46.88 54.91,44.48 62.91,44.48
V_BAT
  Top 0.5: L4.1 48.5,62.98 53.15,67.63 U$17.14 55.15,65.89 58.41,62.63 L2.2
  pour Top (rank 2): 50.81,69.08 50.81,66.18 48.71,64.08 45.31,64.08 45.31,62.18 66.01,62.18 59.11,69.08
V_TDC  (via drill 0.35)
  Top 0.25: U$10.3 40.66,14.73 v40.91,14.48 | U$10.29 37.39,18 36.69,18.7 | U$10.14 45.39,19 v46.91,17.48 47.56,16.83 R31.2 | U$10.22 40.66,21.46 39.89,22.23 C20.2 38.98,21.7 U$10.25 | U$10.26 U$10.25 | U$10.25 38.34,20 37.7,20.64 36.69,20.64 | 36.69,18.7 36.69,20.64 | C18.2 35.42,17.76 v35.9,18.24 36.23,18.24 36.69,18.7 | L9.1 36.69,22.14 36.69,20.64
  Bottom 0.25: 39.51,17.48 39.51,15.88 v40.91,14.48 | v46.91,17.48 39.51,17.48 | 39.51,17.48 38.86,17.48 37.7,16.32 37.12,16.32 35.9,17.54 v35.9,18.24 | 39.51,17.48 39.51,22.13 v39.6,22.23
VCC_TIA
  Top 0.2: 19.44,35.4 21.36,35.4 U$5.P$1
  Top 0.25: D6.P$2 22.91,35.58 22.63,35.85 U$5.P$1 | 19.44,35.4 18.57,35.4 17.85,36.13 C4.1 C1.1 L1.2
VLASER
  Top 0.2: D2.P$1 56.94,49.88 C9.2
  Top 0.5: R5.1 54.81,44.23 52.31,46.73 U$19.1 52.51,49.88 C9.2
  pour Top (no thermals): 57.71,52.18 57.71,48.88 52.01,48.88 52.01,52.18
VLASER_
  Top 0.5: R18.2 L8.1 48.76,47.53 U$19.2

### Text on the board
tPlace: NEON BLADE | LIDAR board [2024] v.2
tNames: MOSI | CS_LIS | GND | CS_NRF | MOSI | CS_LSM | VB | SCK | MISO | 3V3 | CE_RF | SCK | MISO | BUZZ | [NC] | APD_V | BSS131 | ADCMP600 | V_laser | BASS2-02 | APD | LM5114 | 5V | SDIO2 | APD_FB | APD_PWM | ADCMP600 | SDIO3 | SDСMD | [NC] | [NC] | MAX40658 | BAV99 | BSZ165N04NS-G | BASS2-02 | SD_CK | SDIO0 | MISO | CS_TDC | SDIO1 | SDA | SCK | MOSI | SCL | Laser | [NC] | C005R / 32kHz | TDC-GP21 | HC49S / 4 MHz
bNames: MAPD-07-013 | SPL-PL-90_3